# EAGLE design microass2 (EAGLE 5.04)
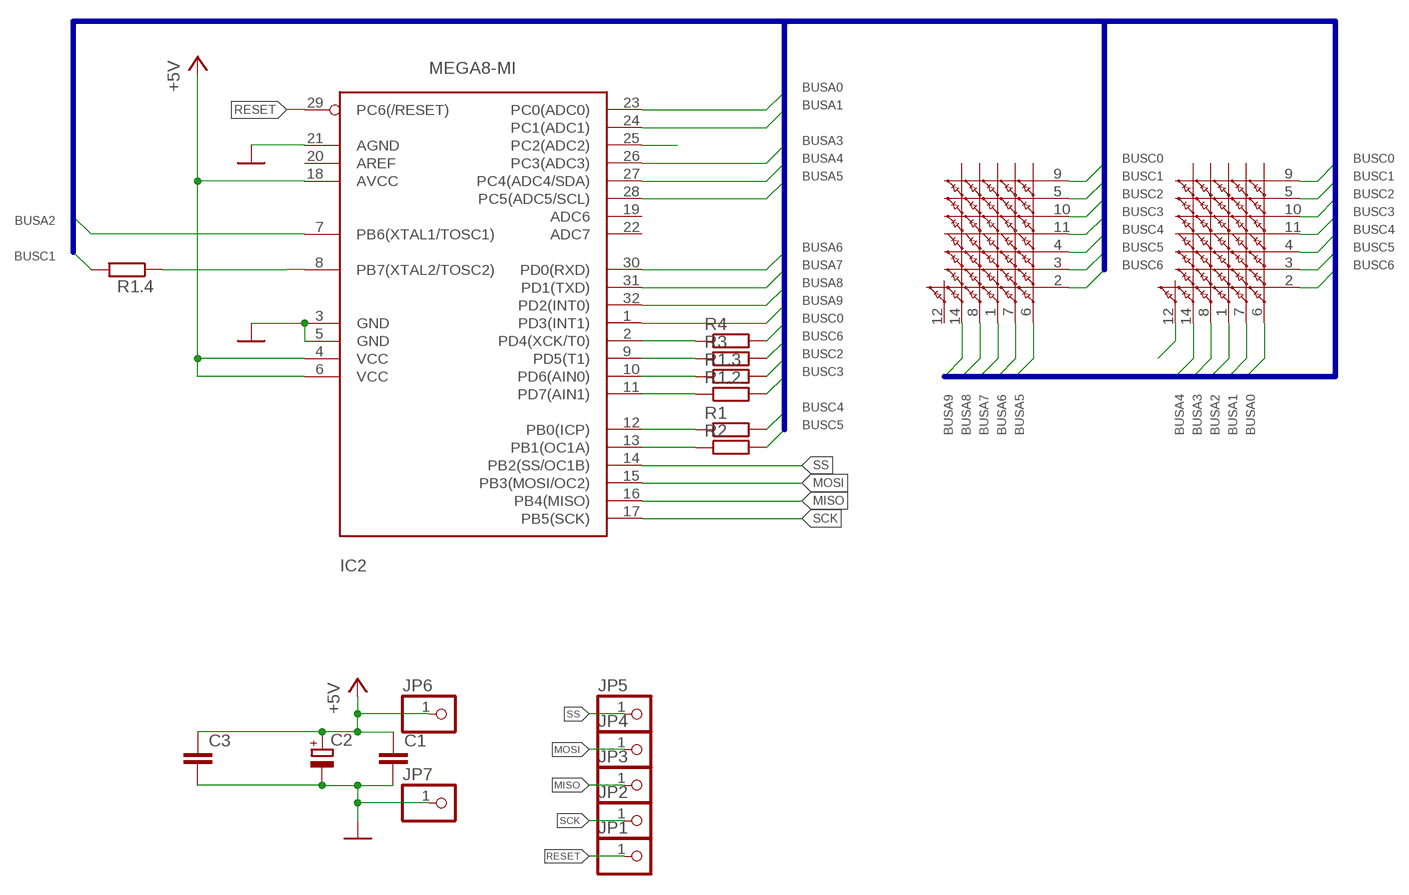
[diagram p0: schematic, sheet 1]

## Parts
C1  C-EUC0603  [C0603]
C2  CPOL-EUA/3216-18R  [A/3216-18R]
C3  C-EUC0603K  [C0603K]
IC2  MEGA8-MI  [MLF32]
JP1  PINHD-1X1  [1X01]
JP2  PINHD-1X1  [1X01]
JP3  PINHD-1X1  [1X01]
JP4  PINHD-1X1  [1X01]
JP5  PINHD-1X1  [1X01]
JP6  PINHD-1X1  [1X01]
JP7  PINHD-1X1  [1X01]
R1  RESARRAY_YC  [RESSMD-YC16]
R2  R-EU_R0402  [R0402]
R3  R-EU_R0402  [R0402]
R4  R-EU_R0603  [R0603]
U$1  ALS363  [ALS-DIL14]
U$2  ALS363  [ALS-DIL14]

## Nets
+5V: C1.1 C2.+ C3.1 IC2.4(VCC) IC2.6(VCC) IC2.18(AVCC) JP6.1
BUSA0: IC2.23(PC0(ADC0)) U$2.6
BUSA1: IC2.24(PC1(ADC1)) U$2.7
BUSA2: IC2.7(PB6(XTAL1/TOSC1)) U$2.1
BUSA3: IC2.26(PC3(ADC3)) U$2.8
BUSA4: IC2.27(PC4(ADC4/SDA)) U$2.14
BUSA5: IC2.28(PC5(ADC5/SCL)) U$1.6
BUSA6: IC2.30(PD0(RXD)) U$1.7
BUSA7: IC2.31(PD1(TXD)) U$1.1
BUSA8: IC2.32(PD2(INT0)) U$1.8
BUSA9: IC2.1(PD3(INT1)) U$1.14
BUSC0: R4.2 U$1.9 U$2.9
BUSC1: R1.R4$2 U$1.5 U$2.5
BUSC2: R1.R3$2 U$1.10 U$2.10
BUSC3: R1.R2$2 U$1.11 U$2.11
BUSC4: R1.R1$2 U$1.4 U$2.4
BUSC5: R2.2 U$1.3 U$2.3
BUSC6: R3.2 U$1.2 U$2.2
GND: C1.2 C2.- C3.2 IC2.3(GND) IC2.5(GND) IC2.21(AGND) JP7.1
MISO: IC2.16(PB4(MISO)) JP3.1
MOSI: IC2.15(PB3(MOSI/OC2)) JP4.1
N$1: IC2.25(PC2(ADC2)) U$2.12
N$3: IC2.10(PD6(AIN0)) R1.R3$1
N$4: IC2.11(PD7(AIN1)) R1.R2$1
N$5: IC2.12(PB0(ICP)) R1.R1$1
N$6: IC2.13(PB1(OC1A)) R2.1
N$7: IC2.9(PD5(T1)) R3.1
N$8: IC2.2(PD4(XCK/T0)) R4.1
N$9: IC2.8(PB7(XTAL2/TOSC2)) R1.R4$1
RESET: IC2.29(PC6(/RESET)) JP1.1
SCK: IC2.17(PB5(SCK)) JP2.1
SS: IC2.14(PB2(SS/OC1B)) JP5.1
Unconnected: IC2.19(ADC6) IC2.20(AREF) IC2.22(ADC7) U$1.12

## Buses
BUSA[0..9],BUSC[0..6]

## Library data of the parts
C1 C3 = rcl:C-EU: CAPACITOR, European symbol
C2 = rcl:CPOL-EU: POLARIZED CAPACITOR, European symbol
IC2 = atmel:MEGA8: MICROCONTROLLER 8 Kbytes FLASH, 1 kbytes SRAM, 512 bytes EEPROM, USART, 6-channel 10 bit ADC, 2-channel 8 bit ADC Pin compatible with Atmega48, ATMega88, ATMega168 Source: avr.lbr
JP1-JP7 = pinhead:PINHD-1X1: PIN HEADER
R1 = 0-svo:RESARRAY_YC*: RESISTOR ARRAY YC16, 1/16W 0.8mm lead pitch
R2-R4 = rcl:R-EU_: RESISTOR, European symbol
U$1 U$2 = 0-svo-ALS363:ALS363*

## Net classes
0 default: width 0.2 mm, drill 0.2 mm

## Board
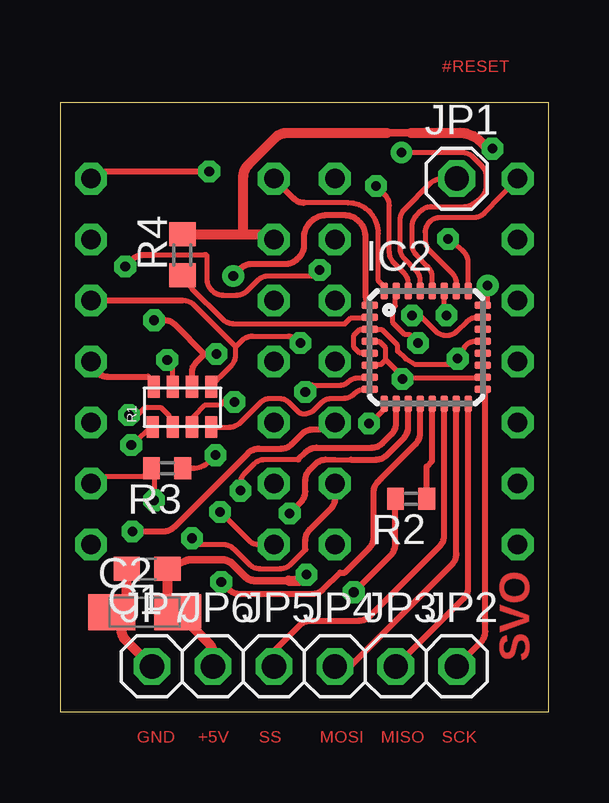
[diagram p1: board, top side]
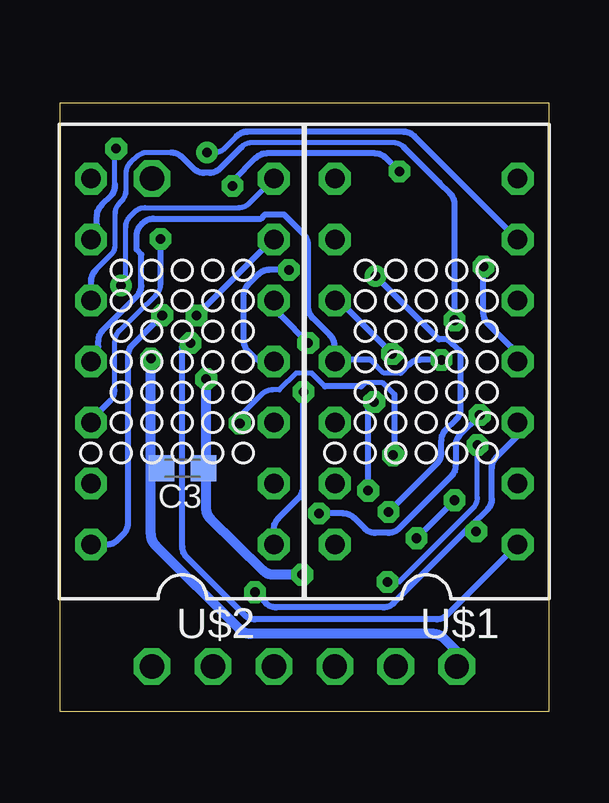
[diagram p2: board, bottom side, seen from below]

Size 20.36 x 25.39 mm. Coordinates in mm from the lower left corner, seen from the top.
Outline: 0,0 20.36,0 20.36,25.39 0,25.39 0,0
Copper layers (1*16): Top 0.035mm / dielectric 1.5mm / Bottom 0.035mm
Design rules: minimum track width 0.2mm, minimum drill 0.4mm, track to track 8mil, track to pad 8mil, pad to pad 8mil, via to via 8mil, smd to smd 8mil, copper to edge 0.5mm, drill to drill 8mil, minimum pad ring 10mil, minimum via ring 8mil, stop-mask expansion 4mil, vias tented up to drill 0.4mm, thermal gap 10mil

### Footprints (pad centres in the part's own frame; a part is rotated, then mirrored left to right if it is on the bottom)
C0603 = smd 1.1 x 1: 1 -0.85,0; 2 0.85,0
A/3216-18R = smd 1.95 x 1.5: + 1.375,0; - -1.375,0
C0603K = smd 1.05 x 1.08: 1 -0.875,0; 2 0.875,0
MLF32 = smd 0.7 x 0.3: 1 -2.35,1.75; 2 -2.35,1.25; 3 -2.35,0.75; 4 -2.35,0.25; 5 -2.35,-0.25; 6 -2.35,-0.75; 7 -2.35,-1.25; 8 -2.35,-1.75; 17 2.35,-1.75; 18 2.35,-1.25; 19 2.35,-0.75; 20 2.35,-0.25; 21 2.35,0.25; 22 2.35,0.75; 23 2.35,1.25; 24 2.35,1.75 | smd 0.3 x 0.7: 9 -1.75,-2.35; 10 -1.25,-2.35; 11 -0.75,-2.35; 12 -0.25,-2.35; 13 0.25,-2.35; 14 0.75,-2.35; 15 1.25,-2.35; 16 1.75,-2.35; 25 1.75,2.35; 26 1.25,2.35; 27 0.75,2.35; 28 0.25,2.35; 29 -0.25,2.35; 30 -0.75,2.35; 31 -1.25,2.35; 32 -1.75,2.35
1X01 = drill 1.016 octagon: 1 0,0
RESSMD-YC16 = smd 0.508 x 0.914: R1$1 -1.23,-0.821; R1$2 -1.2,0.851; R2$1 -0.4,-0.821; R2$2 -0.4,0.851; R3$1 0.4,-0.821; R3$2 0.4,0.851; R4$1 1.2,-0.821; R4$2 1.2,0.851
R0402 = smd 0.7 x 0.9: 1 -0.65,0; 2 0.65,0
R0603 = smd 1 x 1.1: 1 -0.85,0; 2 0.85,0
ALS-DIL14 = drill 0.813 octagon: 1 -7.62,-3.81; 2 -5.08,-3.81; 3 -2.54,-3.81; 4 0,-3.81; 5 2.54,-3.81; 6 5.08,-3.81; 7 7.62,-3.81; 8 7.62,3.81; 9 5.08,3.81; 10 2.54,3.81; 11 0,3.81; 12 -2.54,3.81; 13 -5.08,3.81; 14 -7.62,3.81

### Placement (x,y rotation side)
C1  3.63,5.96 180 top
C2  3.53,4.16 0 top
C3  15.26,10.15 180 bottom
IC2  15.26,15.19 0 top
JP1  16.53,22.22 0 top
JP2  16.53,1.9 0 top
JP3  13.99,1.9 0 top
JP4  11.45,1.9 0 top
JP5  8.91,1.9 0 top
JP6  6.37,1.9 0 top
JP7  3.83,1.9 0 top
R1  5.1,12.7 0 top
R2  14.62,8.88 180 top
R3  4.46,10.15 180 top
R4  5.1,19.04 90 top
U$1  5.1,14.6 90 bottom
U$2  15.26,14.6 90 bottom

### Tracks (layer width: path | path; a pad name or v marks a point on that pad's centre or on a via)
+5V  (via drill 0.4)
  Top 0.2: 13.57,14.67 13.37,14.47 13.22,14.47 IC2.6 | 13.57,14.67 13.57,15.17 13.32,15.42 13.22,15.42 IC2.4 | 14.32,13.92 17.27,13.92 IC2.18 | 14.32,13.92 13.57,14.67 | v14.27,13.87 14.32,13.92
  Top 0.305: 9.52,5.47 8.14,5.47 arc-45 7.69,5.66 7.19,6.16 arc45 6.74,6.35 5.45,6.35 arc25 5.19,6.29 C1.1 | C2.+ 4.48,4.58
  Top 0.406: 4.48,4.58 C1.1 | C2.+ 6.18,2.88 arc-45 6.37,2.43 JP6.1 | 9.52,5.47 10.02,5.47 v10.27,5.72
  Bottom 0.254: 14.27,10.15 C3.1
  Bottom 0.406: v14.27,13.87 14.27,10.15 14.27,8.49 arc-46 14.08,8.03 11.9,5.9 arc-44 11.46,5.72 v10.27,5.72
BUSA0  (via drill 0.4)
  Top 0.2: 14.82,16.52 v14.67,16.52 15,16.52 15.64,15.88 arc45 16.09,15.69 16.11,15.69 arc45 16.56,15.88 16.94,16.26 arc-45 17.39,16.44 IC2.23
  Bottom 0.254: v14.67,16.52 11.92,19.27 U$2.6
BUSA1  (via drill 0.4)
  Top 0.2: v17.82,17.77 17.82,17.07 IC2.24
  Bottom 0.2: v17.82,17.77 v17.82,17.76 17.62,17.96 17.62,20.21 arc45 17.43,20.66 17.27,20.82 arc45 16.82,21.01 12.92,21.01 arc-45 12.47,21.2 U$2.7
  Bottom 0.254: 11.45,21.8 U$2.7
BUSA2  (via drill 0.4)
  Top 0.2: v10.22,13.33 10.52,13.62 11.71,13.62 arc45 11.98,13.73 arc-45 12.43,13.92 12.57,13.92 IC2.7
  Bottom 0.254: U$2.1 11.45,7.62 arc45 11.26,8.07 10.41,8.92 arc-45 10.22,9.37 v10.22,13.33
BUSA3
  Top 0.2: 16.52,17.55 IC2.26 16.51,17.86 arc45 16.32,18.31 15.41,19.22 arc-45 15.22,19.67 15.22,19.97 arc-90 15.86,20.61 17.24,20.61 arc46 17.7,20.8 U$2.8
BUSA4  (via drill 0.4)
  Top 0.2: IC2.27 16.01,16.64 v16.1,16.53
  Bottom 0.254: U$2.14 18.41,6.98 arc-45 17.96,7.17 17.71,7.42 arc-45 17.52,7.87 17.52,14.84 arc45 17.33,15.29 v16.1,16.53
BUSA5  (via drill 0.4)
  Top 0.2: IC2.28 15.51,18.11 arc45 15.32,18.56 14.86,19.02 arc-45 14.67,19.47 14.67,20.25 arc-45 14.86,20.7 15.03,20.87 arc-45 15.48,21.06 16.86,21.06 arc45 17.31,21.25 17.58,21.47 arc45 17.77,21.92 17.77,22.3 arc45 17.58,22.75 17.21,23.12 arc45 16.76,23.3 v14.23,23.3
  Bottom 0.2: v14.23,23.3 13.95,23.3 arc-45 13.5,23.49 13,23.99
  Bottom 0.254: U$1.6 5.6,23.99 arc-45 6.05,24.18 12.55,24.18 arc-45 13,23.99
BUSA6  (via drill 0.4)
  Top 0.2: IC2.30 14.51,17.86 arc45 14.32,18.31 13.91,18.72 arc-45 13.72,19.17 13.72,21.11 arc45 13.53,21.56 v13.17,21.92
  Top 0.254: v6.22,22.52 1.92,22.52 U$1.7
  Bottom 0.254: v6.22,22.52 6.78,23.08 arc-45 7.23,23.27 11.75,23.27 arc-45 12.2,23.08 13.17,22.11 v13.17,21.92
BUSA7  (via drill 0.4)
  Top 0.2: IC2.31 13.97,17.22 13.97,16.92 13.87,16.82 13.87,16.22 14.37,15.72 14.57,15.72 v14.92,15.37
  Bottom 0.2: v14.92,15.37 15.12,15.37 15.26,15.23
  Bottom 0.254: 15.26,15.23 15.26,6.89 arc-45 15.07,6.44 12.68,4.04 arc-45 12.23,3.85 4.68,3.85 arc-45 4.23,4.04 U$1.1
BUSA8
  Top 0.2: IC2.32 13.51,17.72 13.27,17.96 13.27,19.94 arc90 12,21.21 10.18,21.21 10.17,21.22
  Top 0.254: U$1.8 9.72,21.41 arc45 10.17,21.22
BUSA9  (via drill 0.4)
  Top 0.2: v6.67,8.33 7.84,7.17 arc45 8.29,6.98 U$1.14
  Top 0.254: v7.22,18.17 7.53,18.48 arc-45 7.98,18.67 9.42,18.67 arc45 9.87,18.86 9.98,18.97 arc45 10.17,19.42 10.17,19.76 arc-90 11.12,20.71 11.82,20.71 arc-90 12.72,19.81 12.72,17.4 arc45 IC2.1
  Bottom 0.254: v7.22,18.17 4.57,15.52 4.22,15.52 3.67,15.02 3.67,12.63 arc45 3.86,12.18 4.28,11.76 arc-45 4.46,11.31 4.46,10.8 arc45 4.65,10.35 v6.67,8.33
BUSC0  (via drill 0.4)
  Top 0.2: 8.7,19.89 U$1.9 | v18.02,23.47 18.02,23.27
  Top 0.305: 13.62,24.12 14.62,24.12
  Top 0.406: R4.2 7.64,19.89 | 7.64,19.89 8.7,19.89 | 18.02,23.27 17.54,23.75 arc45 16.64,24.12 14.62,24.12 | 7.64,19.89 7.64,22.33 arc-45 7.83,22.78 8.99,23.94 arc-45 9.44,24.12 13.62,24.12
  Bottom 0.2: 18.07,21.98 18.07,23.42 v18.02,23.47
  Bottom 0.254: 18.07,21.98 arc45 18.21,21.53 18.63,21.11 arc-45 18.82,20.66 18.82,20.32 U$2.9
BUSC1  (via drill 0.4)
  Top 0.2: 7.32,15.22 7.32,14.88 arc-45 7.13,14.43 6.67,13.97 R1.R4$2 | 7.32,15.22 5.59,16.95 arc45 5.14,17.14 5.1,17.14 | v10.02,15.37 9.88,15.51 arc45 9.52,15.66 8.02,15.66 arc45 7.57,15.47 7.32,15.22
  Top 0.254: 5.1,17.14 U$1.5
  Bottom 0.254: v10.02,15.37 11.17,16.52 U$2.5
BUSC2  (via drill 0.4)
  Top 0.2: R1.R3$2 5.5,13.9
  Top 0.254: 5.5,13.9 5.5,14.13 arc-45 5.69,14.58 6.02,14.91 | 6.02,14.91 6.5,14.91 arc45 v6.52,14.92 | v3.92,16.32 4.35,16.32 arc-45 4.8,16.13 6.02,14.91
  Bottom 0.2: 6.03,23.53 arc-45 6.48,23.72 12.36,23.72 arc-45 12.81,23.53 12.81,23.52 | 15.73,23.31 16.72,23.31 arc-43 17.15,23.14 17.42,22.9 arc-47 17.62,22.43 17.62,21.72 arc45 17.81,21.27 17.88,21.2 arc-45 18.07,20.75 18.07,19.47 arc45 18.26,19.02 18.88,18.4
  Bottom 0.254: v6.52,14.92 8.37,16.77 U$1.10 | 6.03,23.53 4.55,22.05 4.11,21.61 arc45 3.92,21.16 v3.92,16.32 | U$2.10 19.07,17.72 19.07,17.95 arc45 18.88,18.4 | 12.81,23.52 13.68,22.65 arc45 14.13,22.46 14.36,22.46 arc45 14.81,22.65 15.28,23.12 arc-45 15.73,23.31
BUSC3  (via drill 0.4)
  Top 0.2: R1.R2$2 4.7,14.44 v4.47,14.67
  Bottom 0.2: 6.17,14.12 6.87,14.12 7.42,14.67 | 8.84,14.67 U$1.11 | 18.77,15.22 18.76,15.22
  Bottom 0.254: v4.47,14.67 5.36,14.67 arc-45 5.81,14.48 6.17,14.12 | U$2.11 18.77,15.22 | 7.42,14.67 8.84,14.67 | U$1.11 8.92,15.25 arc-45 9.11,15.7 9.83,16.42 arc45 10.02,16.87 10.02,19.46 arc-45 10.21,19.91 11.02,20.72 11.82,20.72 11.98,20.56 16.46,20.56 arc-45 16.91,20.37 16.98,20.3 arc-45 17.17,19.85 17.17,19.26 16.97,19.06 16.97,17.77 arc45 17.16,17.32 18.57,15.91 arc-45 18.76,15.46 18.76,15.22
BUSC4  (via drill 0.4)
  Top 0.2: 3.67,13.97 R1.R1$2 | v10.82,18.42 10.77,18.42 10.62,18.17 8.68,18.17 arc45 8.23,17.98 7.81,17.56 arc-45 7.36,17.37 6.78,17.37 arc-45 6.33,17.56 6.31,17.58 arc-45 6.12,18.03 6.12,19 arc135 6.01,19.04 3.83,19.04
  Top 0.254: 3.67,13.97 1.98,13.97 arc-66 1.4,14.35 U$1.4 | 3.83,19.04 3.47,19.04 arc45 3.02,18.86 v2.72,18.55
  Bottom 0.2: U$1.4 1.57,15.22
  Bottom 0.254: 1.57,15.22 2.53,16.18 arc45 2.72,16.63 v2.72,18.55 | v10.82,18.42 11.65,18.42 arc-45 12.1,18.23 12.53,17.8 arc-45 12.72,17.35 12.72,15.5 arc-45 12.53,15.05 12.27,14.79 arc-45 11.82,14.6 U$2.4
BUSC5  (via drill 0.4)
  Top 0.254: U$2.3 10.82,11.77 10.53,11.77 arc45 10.08,11.58 9.66,11.16 arc-45 9.21,10.97 8.28,10.97 arc45 7.83,10.78 4.76,7.71 arc-45 4.31,7.52 v3.02,7.52 | v12.24,4.99 13.79,6.54 arc45 13.97,6.99 R2.2
  Bottom 0.2: 3.22,7.77 v3.02,7.52
  Bottom 0.254: v12.24,4.99 11.79,4.54 arc-45 11.34,4.36 6.9,4.36 arc-45 6.45,4.54 3.22,7.77 2.56,8.43 arc-45 2.37,8.88 2.37,10.16 arc45 2.18,10.61 1.29,11.5 U$1.3
BUSC6  (via drill 0.4)
  Top 0.2: U$1.2 1.79,9.76 arc-25 2.06,9.82 3.47,9.82 R3.2 3.92,9.72 v3.92,8.82 | v5.5,7.24 5.76,6.98 6.79,6.98 arc-45 7.24,6.79 7.88,6.16 arc45 8.33,5.97 9.17,5.97 arc45 9.62,6.16 10.22,6.76
  Top 0.254: 10.22,6.76 10.22,7.15 arc-45 10.41,7.6 11.28,8.47 arc45 11.47,8.92 11.47,9.5 U$2.2
  Bottom 0.254: v3.92,8.82 v5.5,7.24
GND  (via drill 0.4)
  Top 0.2: IC2.5 12.57,14.97 12.47,14.97 12.22,15.22 12.22,15.67 12.47,15.92 12.57,15.92 IC2.3 13.22,15.92 13.42,15.92 14.07,15.27 14.07,15.02 14.4,14.71 14.8,14.47 16.32,14.47 v16.57,14.72 | IC2.21 17.29,15.44 arc90 16.77,14.92 v16.57,14.72 | v16.57,14.72 16.47,14.62
  Top 0.305: 2.73,4.28 C2.- 2.56,3.7 2.56,3.43 | 2.73,4.28 2.98,4.33 | 2.73,4.28 2.78,4.33
  Top 0.406: 2.78,4.33 C1.2 | JP7.1 2.75,2.98 arc-45 2.56,3.43
  Bottom 0.2: JP7.1 3.83,2.53
  Bottom 0.254: 16.57,10.15 C3.2
  Bottom 0.406: v16.57,14.72 16.57,10.15 16.57,7.4 arc-45 16.38,6.95 12.88,3.44 arc-45 12.43,3.25 4.81,3.25 arc45 4.36,3.07 3.83,2.53
MISO
  Top 0.254: JP3.1 16.82,4.73 arc45 17.01,5.18 IC2.16
MOSI
  Top 0.2: 16.52,12.52 IC2.15 | JP4.1 12.08,1.9
  Top 0.254: 12.08,1.9 16.33,6.15 arc45 16.52,6.6 16.52,12.52
N$1  (via drill 0.4)
  Top 0.2: IC2.25 17.01,18.72 arc51 16.78,19.21 v16.17,19.71
  Bottom 0.2: U$2.12 19.07,12.16 | 18.26,12.97 arc-45 18.07,13.42 18.07,15.44 arc46 17.88,15.9 16.36,17.37 arc-46 16.17,17.83
  Bottom 0.254: 19.07,12.16 18.26,12.97 | 16.17,17.83 v16.17,19.71
N$3  (via drill 0.4)
  Top 0.2: v7.27,12.92 7.02,13.12 6.67,12.77 6.02,12.77 5.57,12.32 R1.R3$1 | v7.52,9.22 7.52,9.51 arc-45 7.71,9.96 8.08,10.33 arc-45 8.53,10.52 9.92,10.52
  Top 0.254: IC2.10 14.01,12.04 arc-45 13.82,11.59 13.43,11.2 arc-45 12.98,11.01 10.68,11.01 arc45 10.23,10.82 9.93,10.52 9.92,10.52
  Bottom 0.254: v7.52,9.22 7.52,12.67 v7.27,12.92
N$4  (via drill 0.4)
  Top 0.2: v2.87,12.37 3.22,12.37 3.52,12.67 4.22,12.67 4.57,12.32 R1.R2$1 | 11.45,10.51 11.08,10.51 | 11.45,10.51 12.12,10.51 | 11.06,10.51 11.45,10.51
  Top 0.254: IC2.11 14.51,11.86 arc-45 14.32,11.41 13.61,10.7 arc-45 13.16,10.51 12.12,10.51 | v9.57,8.27 10.03,8.74 arc45 10.22,9.19 10.22,9.65 arc-45 10.41,10.1 10.65,10.34 arc-45 11.06,10.51
  Bottom 0.254: v2.87,12.37 3.69,11.55 arc-45 3.88,11.1 3.88,10.26 arc45 4.07,9.81 6.23,7.65 arc45 6.68,7.46 7.22,7.46 arc45 7.67,7.65 8.11,8.08 arc-45 8.56,8.27 v9.57,8.27
N$5  (via drill 0.4)
  Top 0.2: v2.97,11.12 3.62,11.72 R1.R1$1
  Top 0.254: IC2.12 15.01,11.62 arc-45 14.82,11.17 13.37,9.72 13.37,9.71 13.26,9.6 arc45 13.07,9.15 13.07,7.27 arc-45 12.88,6.82 11.87,5.81 11.67,5.81 10.97,5.11 arc-45 10.52,4.92 7.48,4.92 arc-45 7.03,5.11 v6.72,5.42
  Bottom 0.2: v6.72,5.42 6.22,5.42 3.16,8.48 arc-45 2.97,8.93 v2.97,11.12
N$6
  Top 0.254: IC2.13 15.51,10.46 15.28,10.22 R2.1
N$7  (via drill 0.4)
  Top 0.2: IC2.9 13.51,12.61 12.92,12.02 v12.87,12.02 | R3.1 5.53,10.15 arc45 6.23,10.45 v6.48,10.7
  Bottom 0.2: v12.87,12.02 12.87,12.32 11.96,13.23 arc45 11.51,13.42 11.22,13.42 10.52,14.12 9.87,14.12 9.32,13.57 | 7.67,13.71 6.91,13.71 6.42,13.22
  Bottom 0.254: 9.32,13.57 7.81,13.57 7.67,13.71 | 6.42,13.22 6.42,10.76 v6.48,10.7
N$8
  Top 0.2: IC2.2 12.57,16.42 12.12,16.42 11.87,16.17 7.23,16.17 arc-45 6.78,16.36 5.52,17.62 R4.1
N$9
  Top 0.2: IC2.8 12.71,13.44 arc45 12.26,13.26 12.26,13.26 arc-45 11.81,13.07 11.33,13.07 arc45 10.88,12.88 10.61,12.61 arc-45 10.16,12.42 arc-45 9.92,12.52 9.56,12.88 arc45 9.11,13.07 8.78,13.07 arc45 8.33,12.88 7.51,12.06 arc-45 7.06,11.87 R1.R4$1
RESET
  Top 0.2: JP1.1 15.88,22.21 arc45 15.43,22.02 14.36,20.95 arc45 14.17,20.5 14.17,19.32 arc45 14.36,18.87 14.82,18.41 arc-45 15.01,17.96 IC2.29
SCK
  Top 0.2: 17.72,13.32 IC2.17
  Top 0.254: JP2.1 17.53,2.9 arc45 17.72,3.35 17.72,13.32
SS
  Top 0.254: IC2.14 16.01,7.36 arc-45 15.82,6.91 12.91,3.99 arc-45 12.46,3.81 10.44,3.81 arc45 9.99,3.62 8.91,2.53 JP5.1

### Text on the board
Top: #RESET | SVO | GND | +5V | SS | MOSI | MISO | SCK